# Altium project _WEMOS-RTL-01.PrjPCB
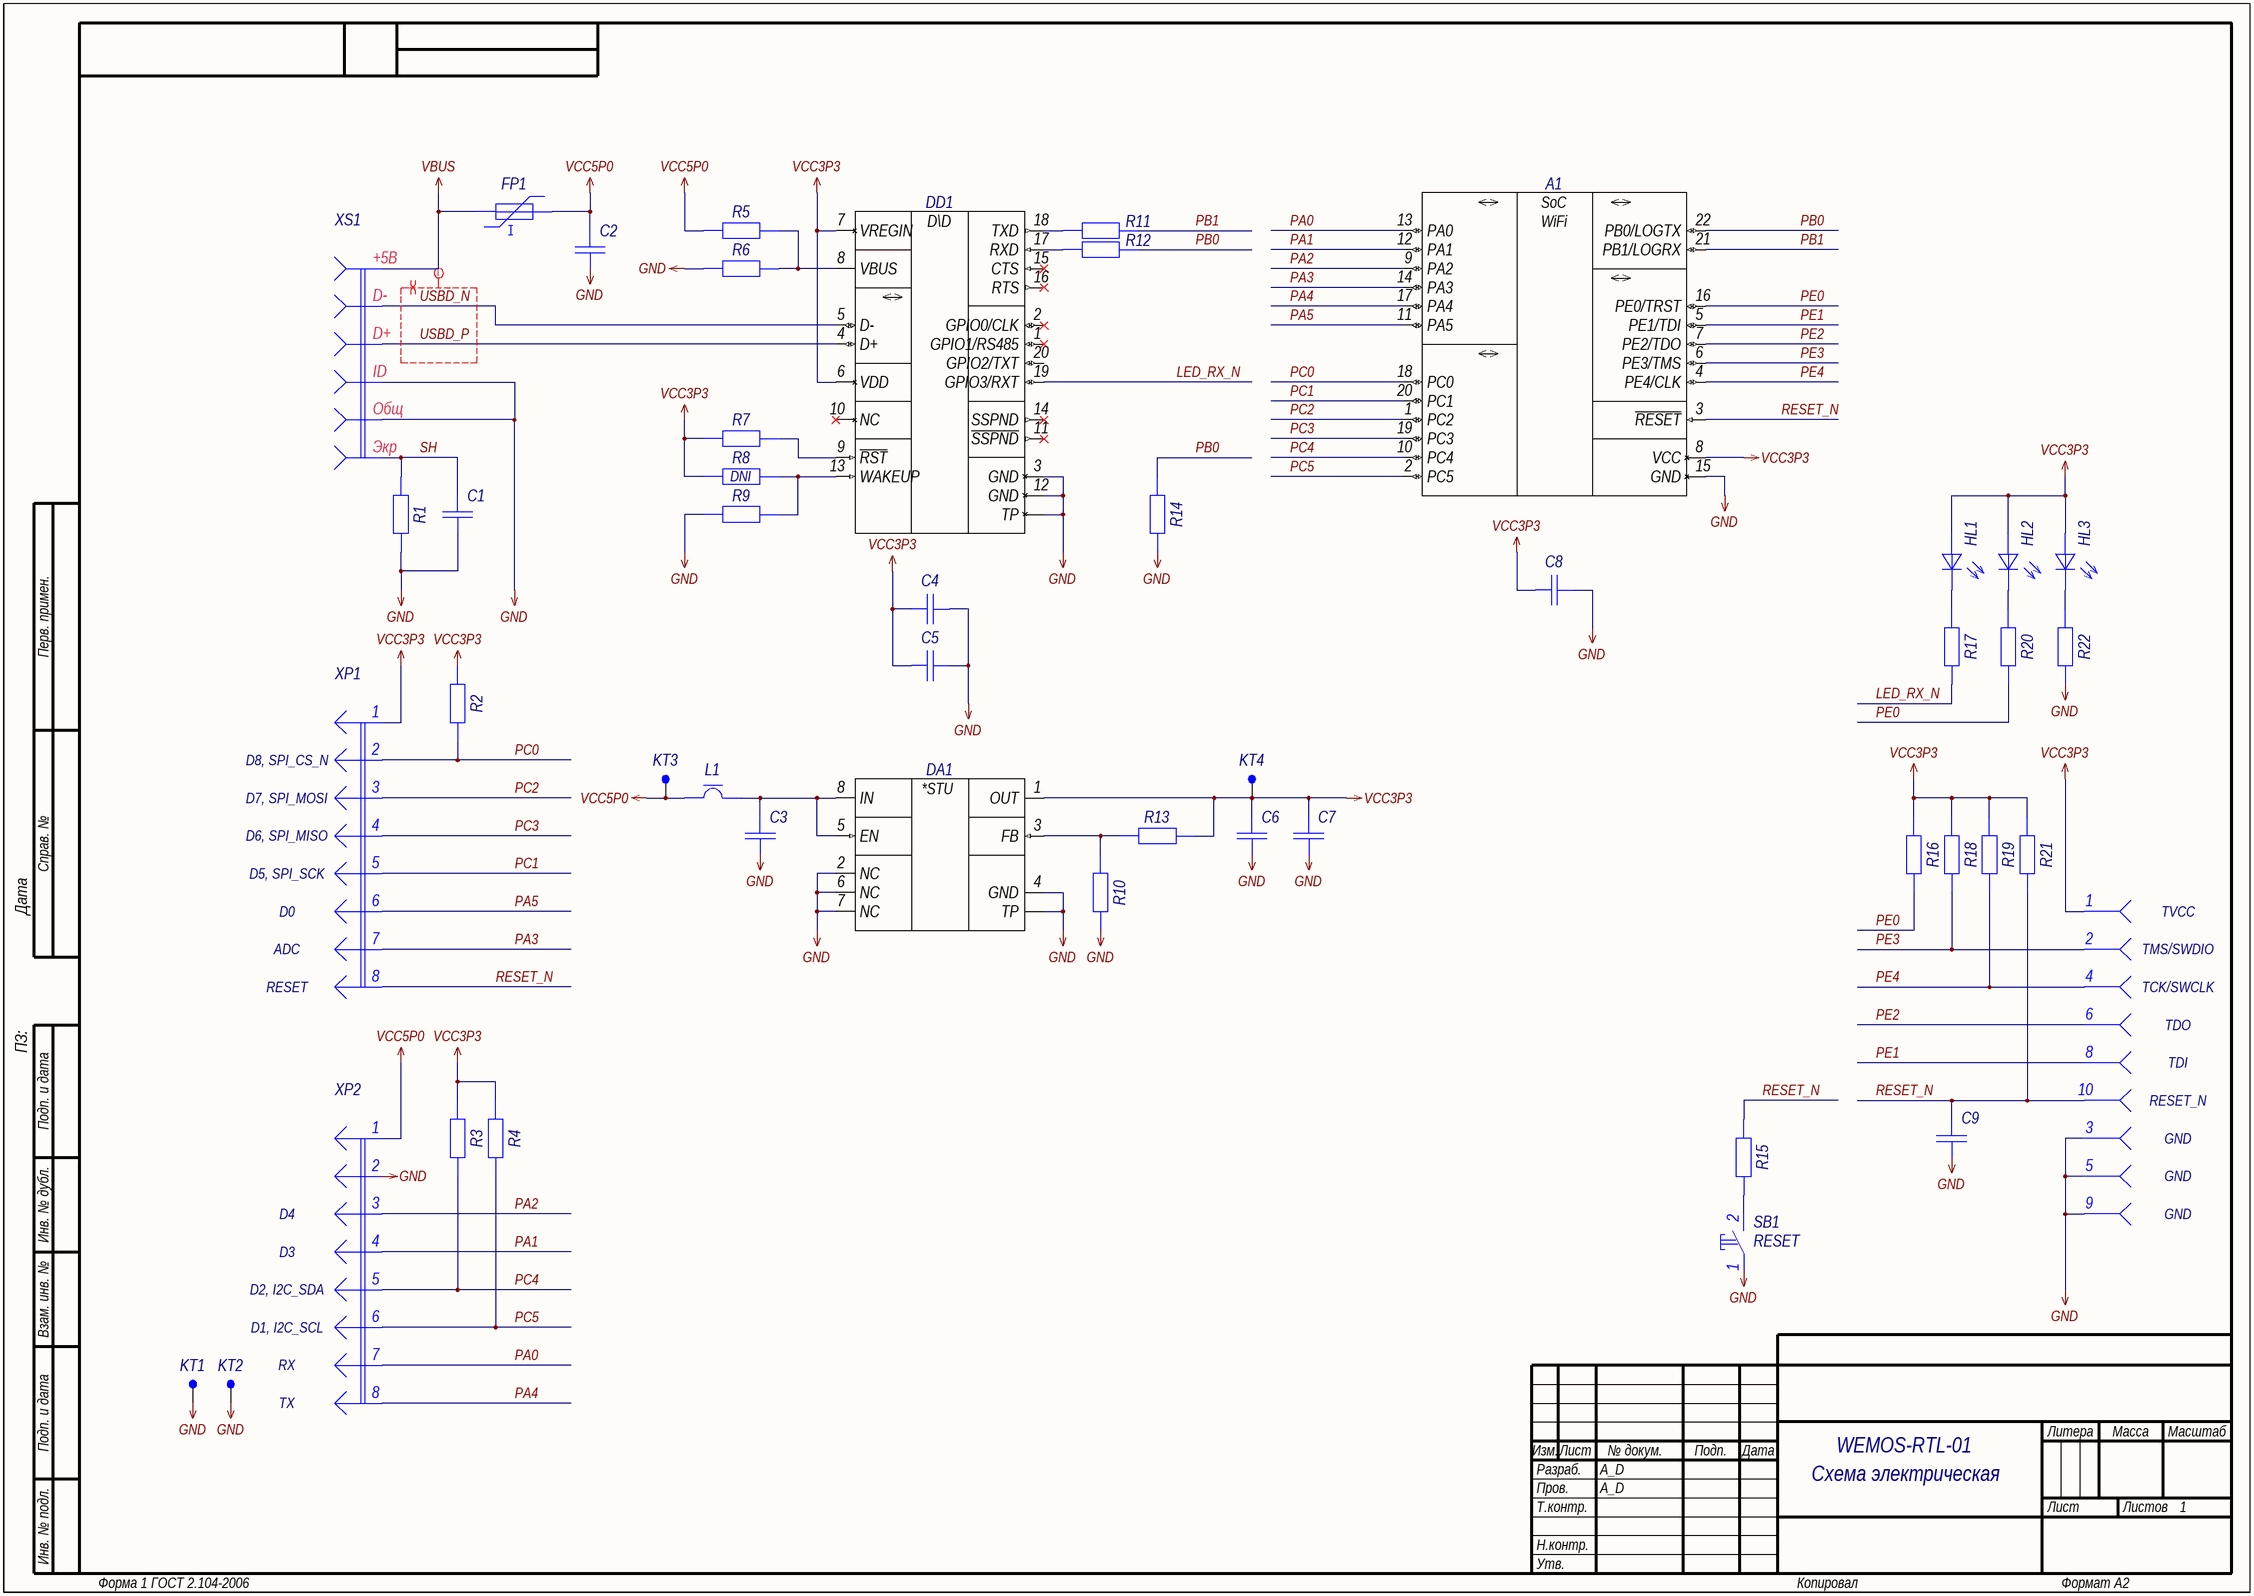
[diagram p0: 01_MAIN.SchDoc]
PCB_Week: 2007; GlobalProjectRevision: 0; GlobalProjectNumber: A_D.000000.001; GlobalProjectName: WEMOS-RTL-01; GlobalOrganizationName: A_D Electronics
1 sheet, 48 parts. Net scope: hierarchical (ports join the sheet entries above them; power ports are global).
Board file: BOARD.PcbDoc

## Sheet 01_MAIN.SchDoc: =GlobalProjectName
size 594 x 420 mm; CheckedBy: A_D; Author: A_D; Organization: A_D Electronics; DocumentNumber: A_D.000000.001 Э3; Revision: 0; SheetTotal: 1; PageSetup: Record=PageOptions|CenterHorizontal=True|CenterVertical=True|PrintScale=0.70|XCorrection=1.00|YCorrection=1.00|PrintKind=2|BorderSize=5000000|LeftOffset=9000|BottomOffset=10100|Orientation=2|PaperLength=11176|PaperWidth=8636|Scale=100|PaperSource=259|PrintQuality=-3|MediaType=1|DitherType=10|PrintScaleMode=1|PaperKind=A3|PaperIndex=8; FirstApplication: A_D.000000.001; DocumentName: WEMOS-RTL-01

### Parts
A1  RTL-00_01  [RTL-00]  (value not drawn)
C1  Capacitor  [C0603_L]  (value not drawn)  (no BOM)
C2  Capacitor  [C0603_L]  (value not drawn)
C3  Capacitor  [C0402_L]  (value not drawn)
C4  Capacitor  [C0402_L]  (value not drawn)
C5  Capacitor  [C0402_L]  (value not drawn)
C6  Capacitor  [C0402_L]  (value not drawn)
C7  Capacitor  [C0402_L]  (value not drawn)
C8  Capacitor  [C0402_L]  (value not drawn)
C9  Capacitor  [C0402_L]  (value not drawn)
DA1  TPS73701DRB  [VSON-8_065P300X300X100_N]  (value not drawn)
DD1  CP2102N-xxx-GQFN20  [QFN-20_050P300X300X080_N]  (value not drawn)
FP1  Fuse_PTC  [F0603_L_H075]  (value not drawn)
HL1  RX  [LD0402_L]  (value not drawn)
HL2  USER  [LD0402_L]  (value not drawn)
HL3  POWER  [LD0402_L]  (value not drawn)
KT1  GND  [TP-SMT-R-0.8mm]  (value not drawn)  (no BOM)
KT2  GND  [TP-SMT-R-0.8mm]  (value not drawn)  (no BOM)
KT3  5P0  [TP-SMT-C-0.5mm]  (value not drawn)  (no BOM)
KT4  3P3  [TP-SMT-C-0.5mm]  (value not drawn)  (no BOM)
L1  FerriteBead  [L0402_L]  (value not drawn)
R1  Resistor  [R0603_L]  (value not drawn)
R2  Resistor  [R0402_L]  (value not drawn)
R3  Resistor  [R0402_L]  (value not drawn)
R4  Resistor  [R0402_L]  (value not drawn)
R5  Resistor  [R0402_L]  (value not drawn)
R6  Resistor  [R0402_L]  (value not drawn)
R7  Resistor  [R0402_L]  (value not drawn)
R8  Resistor  [R0402_L]  (value not drawn)  (no BOM)
R9  Resistor  [R0402_L]  (value not drawn)
R10  Resistor  [R0402_L]  (value not drawn)
R11  Resistor  [R0402_L]  (value not drawn)
R12  Resistor  [R0402_L]  (value not drawn)
R13  Resistor  [R0402_L]  (value not drawn)
R14  Resistor  [R0402_L]  (value not drawn)
R15  Resistor  [R0402_L]  (value not drawn)
R16  Resistor  [R0402_L]  (value not drawn)
R17  Resistor  [R0402_L]  (value not drawn)
R18  Resistor  [R0402_L]  (value not drawn)
R19  Resistor  [R0402_L]  (value not drawn)
R20  Resistor  [R0402_L]  (value not drawn)
R21  Resistor  [R0402_L]  (value not drawn)
R22  Resistor  [R0402_L]  (value not drawn)
SB1  RESET  [1TS003B-Series]
XP1  Text  [PLS-8]  (value not drawn)
XP2  Text  [PLS-8]  (value not drawn)
XS1  Text  [1981568-1]  (value not drawn)
XS2  JTAG  [XF2M-1015-1A]  (value not drawn)  (parts A,B,C,D,E,F,H,I,J of 10)

### Nets
GND: A1.15(GND) C1.1 C2.1 C3.1 C4.1 C5.1 C6.1 C7.1 C8.1 C9.1 DA1.2(NC) DA1.4(GND) DA1.6(NC) DA1.7(NC) DA1.TP DD1.3(GND) DD1.12(GND) DD1.TP KT1.1 KT2.1 R1.1 R6.1 R9.1 R10.1 R14.1 R22.1 SB1.1 XP2.2 XS1.4 XS1.5 XS2.3 XS2.5 XS2.9
VBUS: FP1.1 XS1.1
VCC3P3: A1.8(VCC) C4.2 C5.2 C6.2 C7.2 C8.2 DA1.1(OUT) DD1.6(VDD) DD1.7(VREGIN) HL1.1(А) HL2.1(А) HL3.1(А) KT4.1 R2.1 R3.1 R4.1 R7.2 R8.2 R13.2 R16.1 R18.1 R19.1 R21.1 XP1.1 XS2.1
VCC5P0: C2.2 FP1.2 KT3.1 L1.1 R5.1 XP2.1
LED_RX_N: DD1.19(GPIO3/RXT) R17.1
PA0: A1.13(PA0) XP2.7
PA1: A1.12(PA1) XP2.4
PA2: A1.9(PA2) XP2.3
PA3: A1.14(PA3) XP1.7
PA4: A1.17(PA4) XP2.8
PA5: A1.11(PA5) XP1.6
PB0: A1.22(PB0/LOGTX) R12.2 R14.2
PB1: A1.21(PB1/LOGRX) R11.2
PC0: A1.18(PC0) R2.2 XP1.2
PC1: A1.20(PC1) XP1.5
PC2: A1.1(PC2) XP1.3
PC3: A1.19(PC3) XP1.4
PC4: A1.10(PC4) R3.2 XP2.5
PC5: A1.2(PC5) R4.2 XP2.6
PE0: A1.16(PE0/TRST) R16.2 R20.1
PE1: A1.5(PE1/TDI) XS2.8
PE2: A1.7(PE2/TDO) XS2.6
PE3: A1.6(PE3/TMS) R18.2 XS2.2
PE4: A1.4(PE4/CLK) R19.2 XS2.4
RESET_N: A1.3(~{RESET}) C9.2 R15.2 R21.2 XP1.8 XS2.10
SH: C1.2 R1.2 XS1.6
USBD_N: DD1.5(D-) XS1.2
USBD_P: DD1.4(D+) XS1.3
NetC3_2: C3.2 DA1.5(EN) DA1.8(IN) L1.2
NetDA1_3: DA1.3(FB) R10.2 R13.1
NetDD1_8: DD1.8(VBUS) R5.2 R6.2
NetDD1_9: DD1.9(~{RST}) R7.1
NetDD1_13: DD1.13(WAKEUP) R8.1 R9.2
NetDD1_17: DD1.17(RXD) R12.1
NetDD1_18: DD1.18(TXD) R11.1
NetHL1_2: HL1.2(К) R17.2
NetHL2_2: HL2.2(К) R20.2
NetHL3_2: HL3.2(К) R22.2
NetR15_1: R15.1 SB1.2

Not connected (* = marked no-connect by the designer): DD1 1(GPIO1/RS485)* 2(GPIO0/CLK)* 10(NC)* 11(~{SSPND})* 14(SSPND)* 15(CTS)* 16(RTS)* 20(GPIO2/TXT)

### Layout directives
differential pair; differential pair class USB: USBD_N, USBD_P
rule Matched Net Lengths [Tolerance = 1mm]: USBD_N, USBD_P

### Notes on the sheet
- (near R8) DNI
- (near XP1) D8, SPI_CS_N
- (near XP1) D7, SPI_MOSI
- (near XP1) D6, SPI_MISO
- (near XP1) D5, SPI_SCK
- D0
- TVCC
- ADC
- RESET
- TMS/SWDIO
- TCK/SWCLK
- TDO
- TDI
- RESET_N
- GND
- D4
- D3
- (near XP2) D2, I2C_SDA
- D1, I2C_SCL
- RX
- TX
- Схема электрическая
  принципиальная
- Перв. примен.
- Справ. №
- ПЗ:                             Дата
- Подп. и дата
- Инв. № дубл.
- Взам. инв. №
- Разраб.
- Изм.
- Лист
- № докум.
- Подп.
- Дата
- Литера
- Масса
- Масштаб
- Пров.
- Т.контр.
- Листов
- Инв. № подл.
- Н.контр.
- Утв.
- Форма 1 ГОСТ 2.104-2006
- Копировал
- Формат А2
- (in symbol 1981568-1) +5В; D-; D+; ID; Общ; Экр
- (in symbol CP2102N-A01-GQFN20) D\D
- (in symbol RTL-00) SoC; WiFi
- (in symbol TPS73701DRBR) *STU

### Library data of the parts
A1 = RTL-00: Manufacturer: B&T; ID: 1; Value: RTL-00; Supply Operation: +3.0…3.6V; Supply Current: 150mA; ROM/RAM: 1MB/512KB; Wireless Compatibility: 802.11 b/g/n; Supported Interfaces: JTAG, SWD, SPI, I2C, I2S, UART, PWM, PCM; I/O Lines: 19; Operation Frequency: 166MHz; Working Temperature Min: -20°С; Working Temperature Max: +85°С; Functional Analog: RTL-01, PADI-00, MJIOT-AMB-01S; Published: 12.12.2017; Publisher: Andrew Danich; Type: Модуль; Part Number: RTL-00; Application Category: 1
C1 = GRM188R72A104KA35D: Manufacturer: Murata; Type: Конденсатор; ID: 232; Value: 0.1uF; Voltage: 100V; Tolerance: ±10%; Dielectric Type: X7R; Application Category: 1; Working Temperature Min: -55°С; Working Temperature Max: +125°С; Published: 18.05.2010; Publisher: Andrew Danich; Part Number: GRM188R72A104KA35D; Footprint: 0603; ClassName: DirectConnect
C2 = GRM188R60J106ME47D: Manufacturer: Murata; Type: Конденсатор; ID: 136; Value: 10uF; Voltage: 6.3V; Tolerance: ±20%; Dielectric Type: X5R; Application Category: 1; Working Temperature Min: -55°С; Working Temperature Max: +85°С; Published: 18.05.2010; Publisher: Andrew Danich; Part Number: GRM188R60J106ME47D; Footprint: 0603; ClassName: DirectConnect
C3 C4 C6-C8 = GRM155R60J475ME87D: Manufacturer: Murata; Type: Конденсатор; ID: 223; Value: 4.7uF; Voltage: 6.3V; Tolerance: ±20%; Dielectric Type: X5R; Application Category: 1; Working Temperature Min: -55°С; Working Temperature Max: +85°С; Published: 18.05.2010; Publisher: Andrew Danich; Part Number: GRM155R60J475ME87D; Footprint: 0402; ClassName: DirectConnect
C5 C9 = GCM155R71C104KA55D: Manufacturer: Murata; Type: Конденсатор; ID: 163; Value: 0.1uF; Voltage: 16V; Tolerance: ±10%; Dielectric Type: X7R; Application Category: 1; Working Temperature Min: -55°С; Working Temperature Max: +125°С; Functional Analog: GRM155R71C104KA88D; Published: 18.05.2010; Publisher: Andrew Danich; Part Number: GCM155R71C104KA55D; Footprint: 0402
  C5: ClassName: DirectConnect
DA1 = TPS73701DRBR: Manufacturer: Texas Instruments; ID: 26; Input Voltage: +2.2…5.5V; Output Current: 1A; Output Voltage: +1.2…5.5V; Application Category: 1; Working Temperature Min: -40°С; Working Temperature Max: +125°С; Functional Analog: TPS73701DRBT; Published: 25.03.2019; Publisher: Andrew Danich; Type: Микросхема; Part Number: TPS73701DRBR; Value: TPS73701DRBR; ClassName: DirectConnect
DD1 = CP2102N-A01-GQFN20: Manufacturer: Silicon Labs; ID: 14; Supply Operation: +3.0…3.6V; Supply Current: 13.7mA; USB Type Support: USB 2.0; USB Speed Support: 12 Mb/s; OTG Support: No; Input Interface: UART; Channels: 1; Working Temperature Min: -40°C; Working Temperature Max: +85°C; Functional Analog: CP2102N-A02-GQFN20; Published: 16.07.2019; Publisher: Andrew Danich; Type: Микросхема; Part Number: CP2102N-A01-GQFN20; Value: CP2102N-A01-GQFN20; Application Category: 1
FP1 = 0603L100SLYR: Manufacturer: Littelfuse; ID: 13; Limit Voltage: 6V; Hold Current: 1A; Resistance: 0.12ohm; Trip Current: 1.8A; Current Rating Max: 50A; Application Category: 1; Working Temperature Min: -40°С; Working Temperature Max: +85°С; Published: 25.0.2017; Value: 0603L100SLYR; Type: Предохранитель самовосстанавливающийся; Part Number: 0603L100SLYR; Functional Analog: -
HL1 = KPHHS-1005SURCK: Manufacturer: Kingbright; Type: Индикатор единичный; ID: 35; Forward Voltage: 2.5V; Forward Current: 20mA; Power Dissipation: 75mW; Luminous Flux: 140; Color: Red; Leds: 1; Working Temperature Min: -40°С; Working Temperature Max: +85°С; Published: 03.12.2013; Publisher: Andrew Danich; Part Number: KPHHS-1005SURCK; Value: KPHHS-1005SURCK; Footprint: 0402; Application Category: 1
HL2 = KPHHS-1005QBC-D-V: Manufacturer: Kingbright; Type: Индикатор единичный; ID: 24; Forward Voltage: 3.3V; Forward Current: 20mA; Power Dissipation: 120mW; Luminous Flux: 60; Color: Blue; Leds: 1; Working Temperature Min: -40°С; Working Temperature Max: +85°С; Published: 03.12.2013; Publisher: Andrew Danich; Part Number: KPHHS-1005QBC-D-V; Value: KPHHS-1005QBC-D-V; Footprint: 0402; Application Category: 1
HL3 = KPHHS-1005CGCK: Manufacturer: Kingbright; Type: Индикатор единичный; ID: 25; Forward Voltage: 2.1V; Forward Current: 20mA; Power Dissipation: 75mW; Luminous Flux: 60; Color: Green; Leds: 1; Working Temperature Min: -40°С; Working Temperature Max: +85°С; Published: 03.12.2013; Publisher: Andrew Danich; Part Number: KPHHS-1005CGCK; Value: KPHHS-1005CGCK; Footprint: 0402; Application Category: 1
KT1 KT2 = TestPoint-SMT-GND: ID: 7; Application Type: On PCB Test Point; Application Category: 1; Published: 03.03.2015; Publisher: Andrew Danich; Part Number: TestPoint-SMT-GND; Value: TestPoint-SMT; Manufacturer: -; Functional Analog: -
KT3 KT4 = TestPoint-SMT: ID: 6; Application Type: On PCB Test Point; Application Category: 1; Published: 03.03.2015; Publisher: Andrew Danich; Part Number: TestPoint-SMT; Value: TestPoint-SMT; Manufacturer: -; Functional Analog: -
L1 = BLM15PD121SN1D: Manufacturer: Murata; Type: Дроссель; ID: 11; Rated Current: 1.3A; Impedance at 100Mhz: 120ohm; Tolerance: ±25%; DC Resistance: 0.09ohm; Inductor Type: EMIFIL; Application Category: 1; Working Temperature Min: -55°С; Working Temperature Max: +125°С; Published: 14.11.2014; Publisher: Andrew Danich; Part Number: BLM15PD121SN1D; Value: BLM15PD121SN1D; Footprint: 0402; ClassName: DirectConnect
R1 = RC0603JR-070R: Manufacturer: Yageo; ID: 5; Value: 0; Limit Voltage: 50V; Tolerance: ±5%; Temperature Coefficient: 100ppm; Total Power Dissipation: 0.1W; Series Type: Thick-Film; Application Category: 1; Working Temperature Min: -55°С; Working Temperature Max: +155°С; Functional Analog: RC0603FR-070RL, CR0603-J/-000E; Published: 24.03.2010; Publisher: Andrew Danich; Type: Резистор; Part Number: RC0603JR-070R; Footprint: 0603; ClassName: DirectConnect
R2-R4 R7 R8 R14 R16 R18 R19 R21 = RC0402JR-0710KL: Manufacturer: Yageo; ID: 476; Value: 10k; Limit Voltage: 50V; Tolerance: ±5%; Temperature Coefficient: 100ppm; Total Power Dissipation: 0.1W; Series Type: Thick-Film; Application Category: 1; Working Temperature Min: -55°С; Working Temperature Max: +155°С; Published: 24.03.2010; Publisher: Andrew Danich; Type: Резистор; Part Number: RC0402JR-0710KL; Footprint: 0402
R5 R13 = RC0402FR-0722K1L: Manufacturer: Yageo; ID: 447; Value: 22.1k; Limit Voltage: 50V; Tolerance: ±1%; Temperature Coefficient: 100ppm; Total Power Dissipation: 0.1W; Series Type: Thick-Film; Application Category: 1; Working Temperature Min: -55°С; Working Temperature Max: +155°С; Published: 24.03.2010; Publisher: Andrew Danich; Type: Резистор; Part Number: RC0402FR-0722K1L; Footprint: 0402
R6 = RC0402FR-0747KL: Manufacturer: Yageo; ID: 528; Value: 47k; Limit Voltage: 50V; Tolerance: ±1%; Temperature Coefficient: 100ppm; Total Power Dissipation: 0.1W; Series Type: Thick-Film; Application Category: 1; Working Temperature Min: -55°С; Working Temperature Max: +155°С; Published: 24.03.2010; Publisher: Andrew Danich; Type: Резистор; Part Number: RC0402FR-0747KL; Footprint: 0402
R9 R11 R12 = RC0402JR-070RL: Manufacturer: Yageo; ID: 362; Value: 0; Limit Voltage: 50V; Tolerance: ±5%; Temperature Coefficient: 100ppm; Total Power Dissipation: 0.1W; Series Type: Thick-Film; Application Category: 1; Working Temperature Min: -55°С; Working Temperature Max: +155°С; Published: 24.03.2010; Publisher: Andrew Danich; Type: Резистор; Part Number: RC0402JR-070RL; Footprint: 0402
R10 = RC0402FR-0712KL: Manufacturer: Yageo; ID: 318; Value: 12k; Limit Voltage: 50V; Tolerance: ±1%; Temperature Coefficient: 100ppm; Total Power Dissipation: 0.1W; Series Type: Thick-Film; Application Category: 1; Working Temperature Min: -55°С; Working Temperature Max: +155°С; Published: 24.03.2010; Publisher: Andrew Danich; Type: Резистор; Part Number: RC0402FR-0712KL; Footprint: 0402
R15 = RC0402JR-0720RL: Manufacturer: Yageo; ID: 369; Value: 20; Limit Voltage: 50V; Tolerance: ±5%; Temperature Coefficient: 100ppm; Total Power Dissipation: 0.1W; Series Type: Thick-Film; Application Category: 1; Working Temperature Min: -55°С; Working Temperature Max: +155°С; Published: 24.03.2010; Publisher: Andrew Danich; Type: Резистор; Part Number: RC0402JR-0720RL; Footprint: 0402
R17 R20 R22 = RC0402JR-071KL: Manufacturer: Yageo; ID: 3; Value: 1k; Limit Voltage: 50V; Tolerance: ±5%; Temperature Coefficient: 100ppm; Total Power Dissipation: 0.1W; Series Type: Thick-Film; Application Category: 1; Working Temperature Min: -55°С; Working Temperature Max: +155°С; Published: 24.03.2010; Publisher: Andrew Danich; Type: Резистор; Part Number: RC0402JR-071KL; Footprint: 0402
SB1 = 1TS003B-1600-3500A-CT: Manufacturer: Hongyuan Precision; ID: 38; Limit Voltage: 12V; Limit Current: 50mA; Resistance: 0.1ohm; Isolator Resistance: 100meg; Backlight: NO; Number of Contacts: 2; Application Category: 1; Functional Analog: 1TS003B-1800-3500A-CT; Published: 17.04.2014; Publisher: Andrew Danich; Type: Переключатель; Part Number: 1TS003B-1600-3500A-CT; Value: 1TS003B-1600-3500A-CT; Height: 1.82mm
XP1 XP2 = PLS-8: Value: PLS-8; ID: 7; Limit Voltage: 250V; Limit Current: 3A; Connector Type: Male; Resistance: 15momh; Surface Finish: Gold; Pitch: 2.54mm; Application Category: 1; Published: 07.03.2013; Publisher: Andrew Danich; Type: Вилка; Part Number: PLS-8; Pins: 8
XS1 = 1981568-1: Manufacturer: TE Connectivity; ID: 30; Limit Voltage: 24V; Limit Current: 1A; Connector Type: Female; Interface: USB 2.0; Max Data Rate: 480 mbps; Application Category: 1; Published: 11.04.2016; Publisher: Andrew Danich; Type: Розетка; Part Number: 1981568-1; Value: 1981568-1; Pins: 9; Mount Type: Surface; ClassName: DirectConnect
XS2 = XF2M-1015-1A: Manufacturer: Omron Electronics; ID: 7; Limit Voltage: 50V; Limit Current: 500mA; Connector Type: Female; Resistance: 0.05ohm; Pitch: 0.5mm; Application Category: 1; Working Temperature Min: -30°С; Working Temperature Max: +85°С; Published: 07.09.2015; Publisher: Viktor Klishin; Type: Розетка; Part Number: XF2M-1015-1A; Value: XF2M-1015-1A; Pins: 10; Series: FPC